# EAGLE design polarplotter allegro v3 shield (EAGLE 5.07)
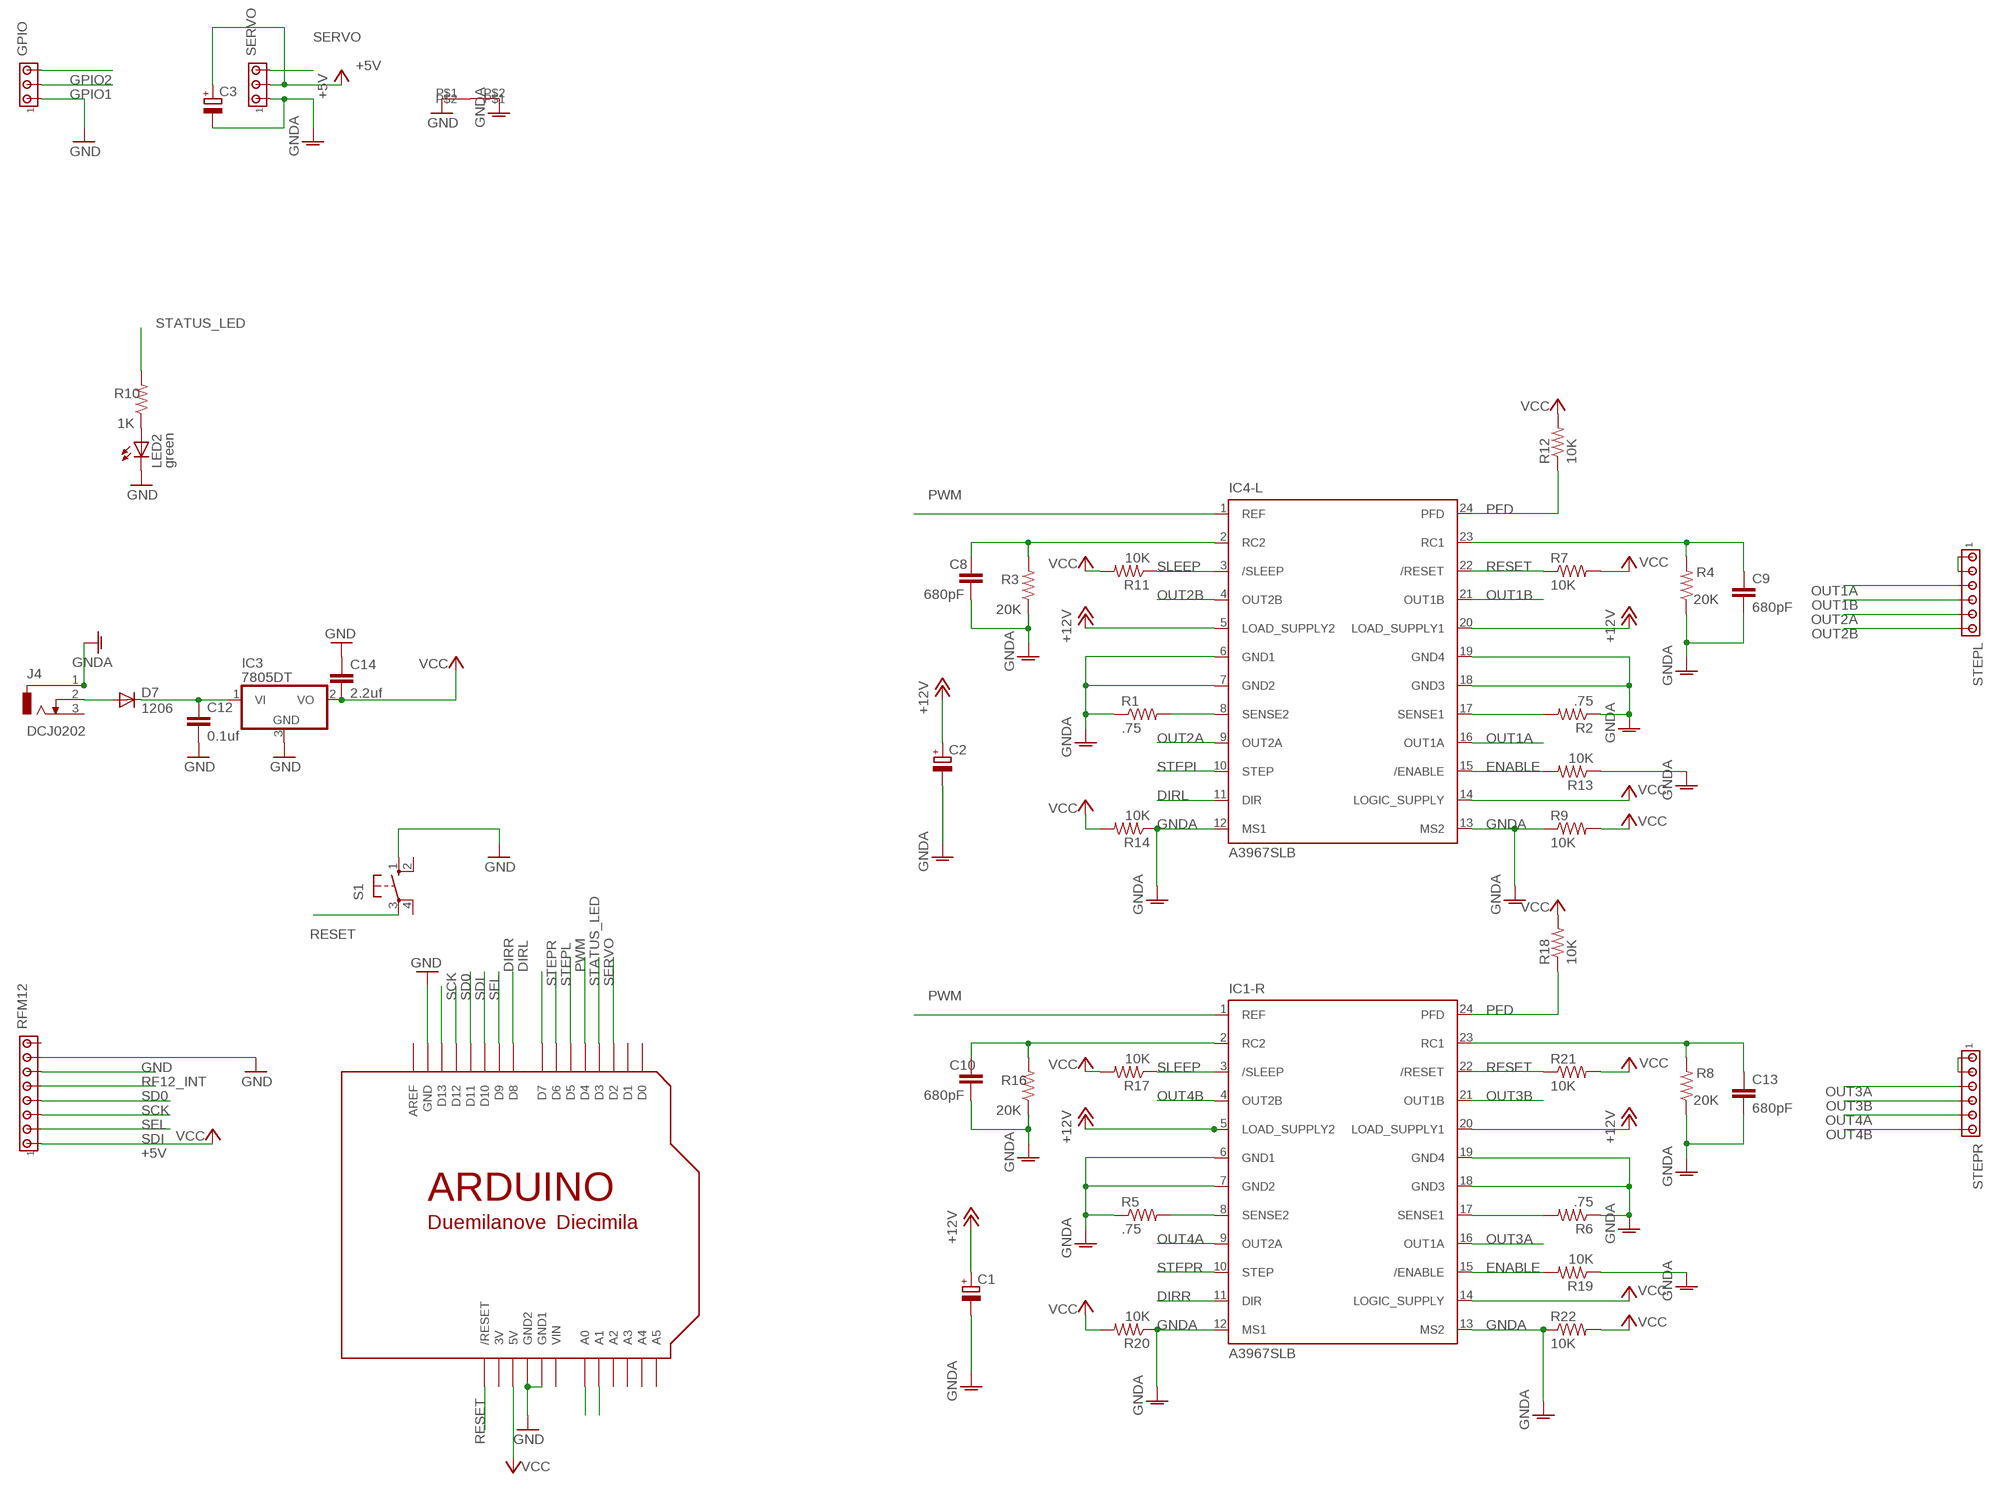
[diagram p0: schematic, sheet 1]

## Parts
C1  CPOL-EUC/6032-28R  [C/6032-28R]
C2  CPOL-EUC/6032-28R  [C/6032-28R]
C3  CPOL-EUC/6032-28R  [C/6032-28R]
C8  680pF  CAP0402  [C0402]
C9  680pF  CAP0402  [C0402]
C10  680pF  CAP0402  [C0402]
C12  0.1uf  C-EUC1206  [C1206]
C13  680pF  CAP0402  [C0402]
C14  2.2uf  C-EUC1206  [C1206]
D7  1206  DIODE-GF1  [GF1]
GPIO  MTA03-100  [10X03MTA]
IC1-R  A3967SLB  [SO24W]
IC3  7805DT  [TO252]
IC4-L  A3967SLB  [SO24W]
J4  DCJ0202  [DCJ0202]
LED2  green  LED5MM  [LED5MM]
R1  .75  R-US_R0805  [R0805]
R2  .75  R-US_R0805  [R0805]
R3  20K  RESISTOR0402  [C0402]
R4  20K  RESISTOR0402  [C0402]
R5  .75  R-US_R0805  [R0805]
R6  .75  R-US_R0805  [R0805]
R7  10K  RESISTOR0402  [C0402]
R8  20K  RESISTOR0402  [C0402]
R9  10K  RESISTOR0402  [C0402]
R10  1K  RESISTOR0402  [C0402]
R11  10K  RESISTOR0402  [C0402]
R12  10K  RESISTOR0402  [C0402]
R13  10K  RESISTOR0402  [C0402]
R14  10K  RESISTOR0402  [C0402]
R16  20K  RESISTOR0402  [C0402]
R17  10K  RESISTOR0402  [C0402]
R18  10K  RESISTOR0402  [C0402]
R19  10K  RESISTOR0402  [C0402]
R20  10K  RESISTOR0402  [C0402]
R21  10K  RESISTOR0402  [C0402]
R22  10K  RESISTOR0402  [C0402]
RFM12  MTA08-100  [10X08MTA]
S1  10-XX  [B3F-10XX]
SERVO  MTA03-100  [10X03MTA]
STEPL  MTA06-100  [10X06MTA]
STEPR  MTA06-100  [10X06MTA]
U$1  ARDUINO-NOHOLE  [ARDUINO-NOHOLE]
U$4  SHORT  [SHORT]

## Nets
+5V: C3.+ R12.2 R18.2 RFM12.1 SERVO.2 U$1.5V ; supply symbol labelled VCC
+12V [power]: C1.+ C2.+ IC1-R.5(LOAD_SUPPLY2) IC1-R.20(LOAD_SUPPLY1) IC4-L.5(LOAD_SUPPLY2) IC4-L.20(LOAD_SUPPLY1)
DIRL: IC4-L.11(DIR) U$1.D8
DIRR: IC1-R.11(DIR) U$1.D9
ENABLE: IC1-R.15(/ENABLE) IC4-L.15(/ENABLE) R13.2 R19.2
GND: C12.2 C14.1 GPIO.1 IC3.3(GND) LED2.K(C) RFM12.7 S1.1(S) U$1.GND U$1.GND1 U$1.GND2 U$4.P$1
GNDA [power]: C1.- C2.- C3.- C8.2 C9.2 C10.2 C13.2 IC1-R.6(GND1) IC1-R.7(GND2) IC1-R.12(MS1) IC1-R.13(MS2) IC1-R.18(GND3) IC1-R.19(GND4) IC4-L.6(GND1) IC4-L.7(GND2) IC4-L.12(MS1) IC4-L.13(MS2) IC4-L.18(GND3) IC4-L.19(GND4) J4.1 R1.1 R2.1 R3.1 R4.1 R5.1 R6.1 R8.1 R9.1 R13.1 R14.1 R16.1 R19.1 R20.1 R22.1 SERVO.1 U$4.P$2
GPIO1: GPIO.2 U$1.A0
GPIO2: GPIO.3 U$1.A1
MOTORSUPPLY [power]: STEPL.5 STEPL.6
MOTORSUPPLY1 [power]: STEPR.5 STEPR.6
N$1: IC1-R.8(SENSE2) R5.2
N$2: D7.A J4.2
N$3: IC4-L.8(SENSE2) R1.2
N$4: IC1-R.17(SENSE1) R6.2
N$5: LED2.A R10.1
N$6: C10.1 IC1-R.2(RC2) R16.2
N$7: C13.1 IC1-R.23(RC1) R8.2
N$10 [medpower]: C12.1 D7.C IC3.1(VI)
N$14: IC4-L.17(SENSE1) R2.2
N$16: C8.1 IC4-L.2(RC2) R3.2
N$20: C9.1 IC4-L.23(RC1) R4.2
OUT1A: IC4-L.16(OUT1A) STEPL.4
OUT1B: IC4-L.21(OUT1B) STEPL.3
OUT2A: IC4-L.9(OUT2A) STEPL.2
OUT2B: IC4-L.4(OUT2B) STEPL.1
OUT3A: IC1-R.16(OUT1A) STEPR.4
OUT3B: IC1-R.21(OUT1B) STEPR.3
OUT4A: IC1-R.9(OUT2A) STEPR.2
OUT4B: IC1-R.4(OUT2B) STEPR.1
PFD: IC1-R.24(PFD) IC4-L.24(PFD) R12.1 R18.1
PWM: IC1-R.1(REF) IC4-L.1(REF) U$1.D5
RESET: IC1-R.22(/RESET) IC4-L.22(/RESET) R7.1 R21.1 S1.3(P) U$1.RESET(/RESET)
RF12_INT: RFM12.6 U$1.D2
SCK: RFM12.4 U$1.D13
SD0: RFM12.5 U$1.D12
SDI: RFM12.2 U$1.D11
SEL: RFM12.3 U$1.D10
SERVO: SERVO.3 U$1.D3
SLEEP: IC1-R.3(/SLEEP) IC4-L.3(/SLEEP) R11.1 R17.1
STATUS_LED: R10.2 U$1.D4
STEPL: IC4-L.10(STEP) U$1.D6
STEPR: IC1-R.10(STEP) U$1.D7
VCC: C14.2 IC1-R.14(LOGIC_SUPPLY) IC3.2(VO) IC4-L.14(LOGIC_SUPPLY) R7.2 R9.2 R11.2 R14.2 R17.2 R20.2 R21.2 R22.2
Unconnected: J4.3 RFM12.8 S1.2(S1) S1.4(P1) U$1.A2 U$1.A3 U$1.A4 U$1.A5 U$1.AREF U$1.D0 U$1.D1

## Power pins joined to a net without a drawn wire
3V: U$1.3V
VIN: U$1.VIN

## Library data of the parts
C1-C3 = matt rcl:CPOL-EU: POLARIZED CAPACITOR, European symbol
C8-C10 C13 = SparkFun03_30_09:CAP: Capacitor Standard 0603 ceramic capacitor, and 0.1" leaded capacitor.
C12 C14 = resistor:C-EU: CAPACITOR, European symbol
D7 = matt diode:DIODE-: DIODE
GPIO SERVO = matt con-amp:MTA03-100: AMP connector
IC1-R IC4-L = Allegro:A3967SLB: ANALOG DEVICES
IC3 = linear:78*: Positive VOLTAGE REGULATOR Source: http://cache.national.com/ds/LM/LM78L05.pdf http://www.fairchildsemi.com/ds/LM/LM7805.pdf
J4 = con-jack:DCJ0202: DC POWER JACK Source: DCJ0202.pdf
LED2 = matt led:LED: LED OSRAM: - CHIPLED LG R971, LG N971, LY N971, LG Q971, LY Q971, LO R971, LY R971 LH N974, LH R974 LS Q976, LO Q976, LY Q976 LO Q996 - Hyper CHIPLED LW Q18S LB Q993, LB Q99A, LB R99A - SideLED LS A670, LO A670, LY A670, LG A670, LP A670 LB A673, LV A673, LT A673, LW A673 LH A674 LY A675 LS A676, LA A676, LO A676, LY A676, LW A676 LS A679, LY A679, LG A679 - Hyper Micro SIDELED® LS Y876, LA Y876, LO Y876, LY Y876 LT Y87S - SmartLED LW L88C, LW L88S LB L89C, LB L89S, LG L890 LS L89K, LO L89K, LY L89K LS L896, LA L896, LO L896, LY L896 - TOPLED LS T670, LO T670, LY T670, LG T670, LP T670 LSG T670, LSP T670, LSY T670, LOP T670, LYG T670 LG T671, LOG T671, LSG T671 LB T673, LV T673, LT T673, LW T673 LH T674 LS T676, LA T676, LO T676, LY T676, LB T676, LH T676, LSB T676, LW T676 LB T67C, LV T67C, LT T67C, LS T67K, LO T67K, LY T67K, LW E67C LS E67B, LA E67B, LO E67B, LY E67B, LB E67C, LV E67C, LT E67C LW T67C LS T679, LY T679, LG T679 LS T770, LO T770, LY T770, LG T770, LP T770 LB T773, LV T773, LT T773, LW T773 LH T774 LS E675, LA E675, LY E675, LS T675 LS T776, LA T776, LO T776, LY T776, LB T776 LHGB T686 LT T68C, LB T68C - Hyper Mini TOPLED® LB M676 - Mini TOPLED Santana® LG M470 LS M47K, LO M47K, LY M47K Source: http://www.osram.convergy.de LUXEON: - LUMILED® LXK2-PW12-R00, LXK2-PW12-S00, LXK2-PW14-U00, LXK2-PW14-V00 LXK2-PM12-R00, LXK2-PM12-S00, LXK2-PM14-U00 LXK2-PE12-Q00, LXK2-PE12-R00, LXK2-PE12-S00, LXK2-PE14-T00, LXK2-PE14-U00 LXK2-PB12-K00, LXK2-PB12-L00, LXK2-PB12-M00, LXK2-PB14-N00, LXK2-PB14-P00, LXK2-PB14-Q00 LXK2-PR12-L00, LXK2-PR12-M00, LXK2-PR14-Q00, LXK2-PR14-R00 LXK2-PD12-Q00, LXK2-PD12-R00, LXK2-PD12-S00 LXK2-PH12-R00, LXK2-PH12-S00 LXK2-PL12-P00, LXK2-PL12-Q00, LXK2-PL12-R00 Source: www.luxeon.com KINGBRIGHT: KA-3528ASYC Source: www.kingbright.com
R1 R2 R5 R6 = rcl:R-US_: RESISTOR, American symbol
R3 R4 R7-R14 R16-R22 = SparkFun03_30_09:RESISTOR: Resistor Basic schematic elements and footprints for 0603, 1206, and PTH 1/10th watt (small) resistors.
RFM12 = matt con-amp:MTA08-100: AMP connector
S1 = switch-omron:10-XX: OMRON SWITCH
STEPL STEPR = matt con-amp:MTA06-100: AMP connector
U$1 = adafruit:ARDUINO: Arduino Diecimila/Duemilanove Make a shield with ease, this package has all the named pins as well as the two mounting drill holes and an outline of the USB and DC power connector. The outline is on the DIMENSION layer, so if your board house uses it they will cut the outline to match. http://www.ladyada.net/library/pcb/eaglelibrary.html
U$4 = matt:SHORT

## Net classes
1 power: width 3 mm
2 medpower: width 1 mm

## Board
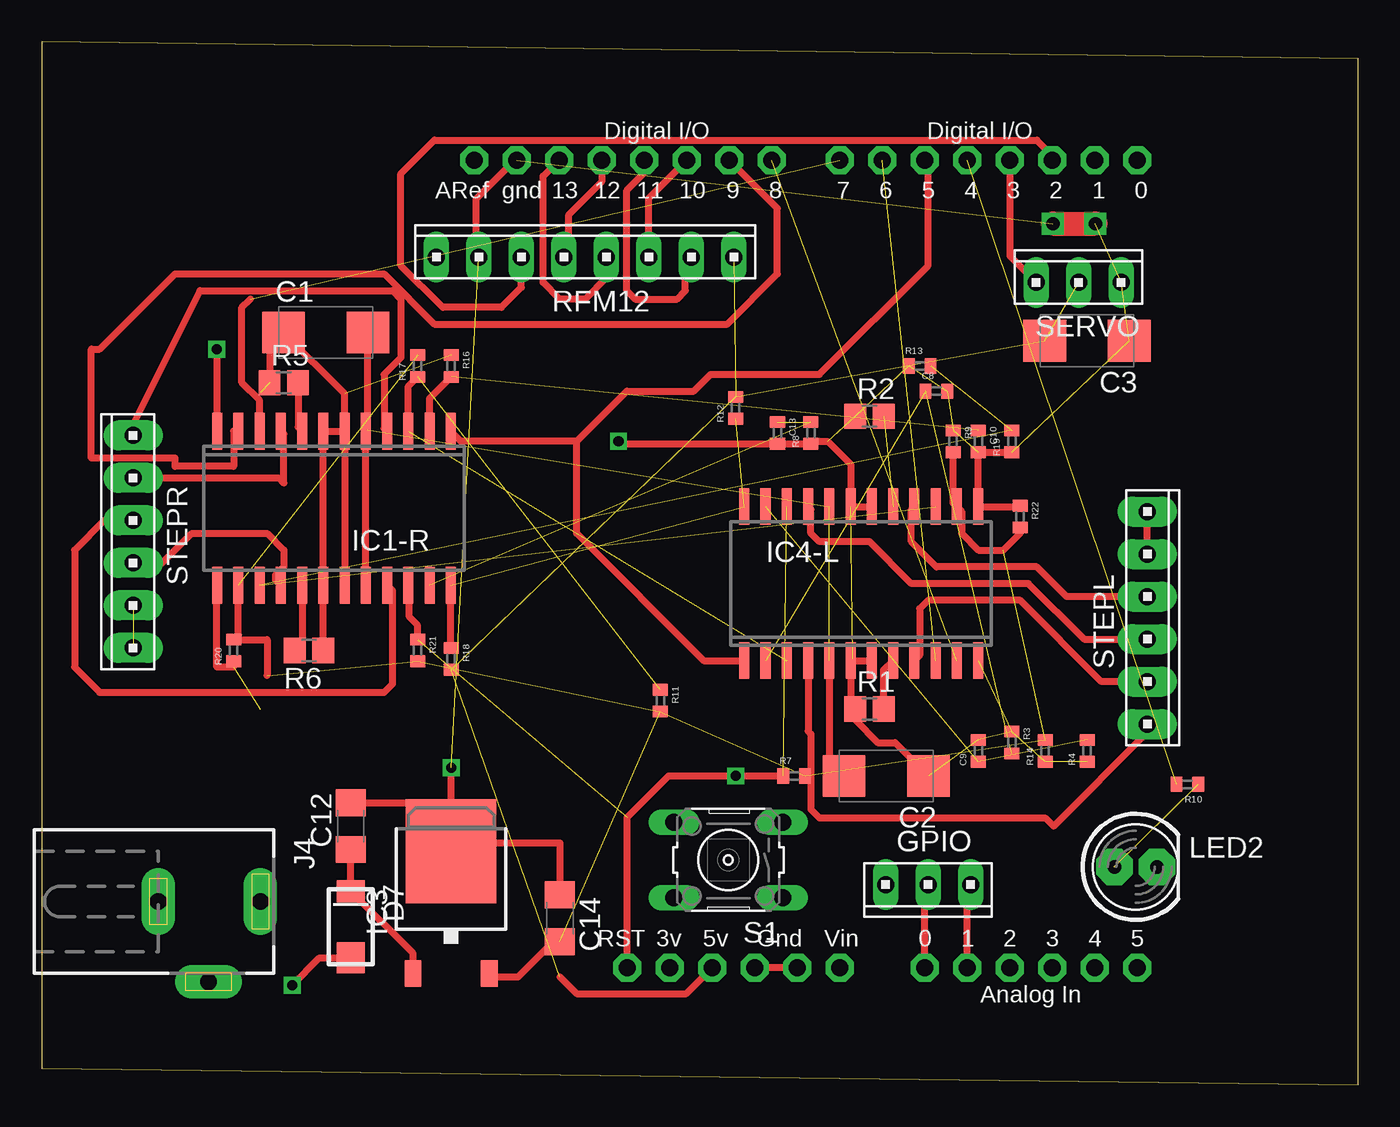
[diagram p1: board, top side]
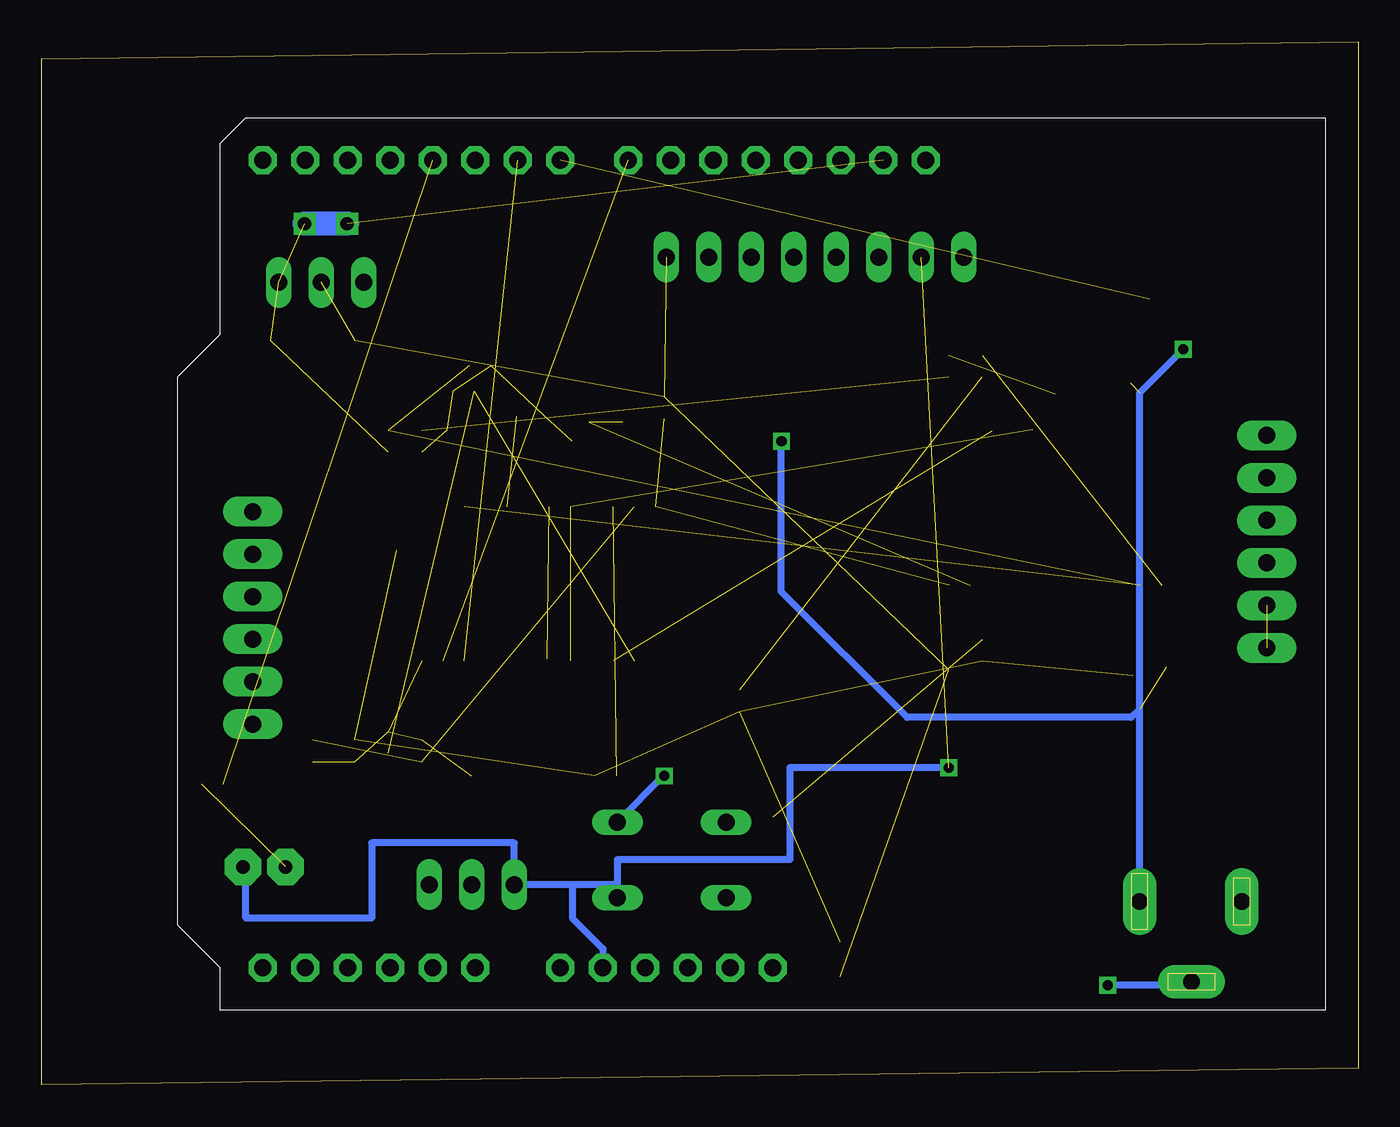
[diagram p2: board, bottom side, seen from below]

Size 78.66 x 62.33 mm. Coordinates in mm from the lower left corner, seen from the top.
Outline: 0,1 78.66,0 78.66,61.33 0,62.33 0,1
Copper layers (1*16): Top 0.035mm / dielectric 1.5mm / Bottom 0.035mm
Design rules "default": minimum track width 10mil, minimum drill 24mil, track to track 8mil, track to pad 8mil, pad to pad 8mil, via to via 8mil, smd to smd 8mil, copper to edge 40mil, drill to drill 8mil, minimum pad ring 10mil, minimum via ring 8mil, stop-mask expansion 4mil, vias tented up to drill 0mil, thermal gap 10mil

### Footprints (pad centres in the part's own frame; a part is rotated, then mirrored left to right if it is on the bottom)
C/6032-28R = smd 2.55 x 2.5: + 2.525,0; - -2.525,0
C0402 = smd 0.7 x 0.9: 1 -0.65,0; 2 0.65,0
C1206 = smd 1.6 x 1.8: 1 -1.4,0; 2 1.4,0
GF1 = smd 1.85 x 1.68: A 1.87,0 | smd 1.32 x 1.68: C -2.12,0
10X03MTA = drill 1.016 long: 1 2.54,0; 2 0,0; 3 -2.54,0
SO24W = smd 0.6 x 2.2: 1 -6.985,-4.6; 2 -5.715,-4.6; 3 -4.445,-4.6; 4 -3.175,-4.6; 5 -1.905,-4.6; 6 -0.635,-4.6; 7 0.635,-4.6; 8 1.905,-4.6; 9 3.175,-4.6; 10 4.445,-4.6; 11 5.715,-4.6; 12 6.985,-4.6; 13 6.985,4.6; 14 5.715,4.6; 15 4.445,4.6; 16 3.175,4.6; 17 1.905,4.6; 18 0.635,4.6; 19 -0.635,4.6; 20 -1.905,4.6; 21 -3.175,4.6; 22 -4.445,4.6; 23 -5.715,4.6; 24 -6.985,4.6
TO252 = smd 1 x 1.6: 1 -2.28,-4.8; 2 2.28,-4.8 | smd 5.4 x 6.2: 3 0,2.5
DCJ0202 = drill 1 pad 2 long: 1 0,3.1; 2 4.8,0; 3 0,-3
LED5MM = drill 0.813 pad 2.184 octagon: A -1.27,0; K 1.27,0
R0805 = smd 1.3 x 1.5: 1 -0.85,0; 2 0.85,0
10X08MTA = drill 1.016 long: 1 8.89,0; 2 6.35,0; 3 3.81,0; 4 1.27,0; 5 -1.27,0; 6 -3.81,0; 7 -6.35,0; 8 -8.89,0
B3F-10XX = drill 1.016 long: 1 -3.251,2.261; 2 3.251,2.261; 3 -3.251,-2.261; 4 3.251,-2.261
10X06MTA = drill 1.016 pad 1.778 long: 1 6.35,0; 2 3.81,0; 3 1.27,0; 4 -1.27,0; 5 -3.81,0; 6 -6.35,0
ARDUINO-NOHOLE = drill 1 pad 1.676 octagon: 3V 35.56,2.54; 5V 38.1,2.54; A0 50.8,2.54; A1 53.34,2.54; A2 55.88,2.54; A3 58.42,2.54; A4 60.96,2.54; A5 63.5,2.54; AREF 23.876,50.8; D0 63.5,50.8; D1 60.96,50.8; D2 58.42,50.8; D3 55.88,50.8; D4 53.34,50.8; D5 50.8,50.8; D6 48.26,50.8; D7 45.72,50.8; D8 41.656,50.8; D9 39.116,50.8; D10 36.576,50.8; D11 34.036,50.8; D12 31.496,50.8; D13 28.956,50.8; GND 26.416,50.8; GND1 43.18,2.54; GND2 40.64,2.54; RESET 33.02,2.54; VIN 45.72,2.54
SHORT = drill 0.8 square: P$1 -2.54,0; P$2 0,0

### Placement (x,y rotation side)
C1  16.96,44.96 0 top
C2  50.46,18.46 180 top
C3  62.46,44.46 180 top
C8  53.46,41.46 0 top
C9  55.96,19.96 90 top
C10  55.96,38.46 270 top
C12  18.46,15.46 90 top
C13  43.96,38.96 270 top
C14  30.96,9.96 270 top
D7  18.46,9.46 270 top
GPIO  52.96,11.96 180 top
IC1-R  17.46,34.46 180 top
IC3  24.46,11.46 0 top
IC4-L  48.96,29.96 0 top
J4  9.96,10.96 270 top
LED2  65.36,13.03 0 top
R1  49.46,22.46 0 top
R2  49.46,39.96 0 top
R3  57.96,20.46 270 top
R4  62.46,19.96 90 top
R5  14.46,41.96 0 top
R6  15.96,25.96 180 top
R7  44.96,18.46 0 top
R8  45.96,38.96 90 top
R9  54.46,38.46 270 top
R10  68.46,17.96 180 top
R11  36.96,22.96 270 top
R12  41.46,40.46 90 top
R13  52.46,42.96 0 top
R14  59.96,19.96 90 top
R16  24.46,42.96 270 top
R17  22.46,42.96 90 top
R18  24.46,25.46 270 top
R19  57.96,38.46 90 top
R20  11.46,25.96 90 top
R21  22.46,25.96 270 top
R22  58.46,33.96 270 top
RFM12  32.46,49.46 0 top
S1  41.02,13.44 180 top
SERVO  61.96,47.96 0 top
STEPL  66.06,27.91 270 top
STEPR  5.46,32.46 90 top
U$1  1.96,4.46 0 top
U$4  62.96,51.46 0 top

### Tracks (layer width: path | path; a pad name or v marks a point on that pad's centre or on a via)
+5V  (5 unrouted)
  Top 0.406: 30.96,6.46 31.96,5.46 38.52,5.46 U$1.5V
+12V  (2 unrouted)
  Top 0.406: C1.+ 19.48,39.98 19.46,39.96 19.46,39.16 IC1-R.5 IC1-R.20 | IC4-L.5 47.05,19.34 C2.+
DIRL  (1 unrouted)
DIRR
  Top 0.406: IC1-R.11 11.46,39.06 11.46,36.96 7.96,36.96 7.96,37.46 2.96,37.46 2.96,43.96 3.46,43.96 7.96,48.46 20.46,48.46 23.46,45.46 40.96,45.46 43.96,48.46 43.96,52.38 U$1.D9
ENABLE  (3 unrouted)
GND  (via drill 0.6)  (2 unrouted)
  Top 0.406: C12.2 24.46,16.86 | 24.46,16.86 24.46,14.46 | 24.46,14.46 IC3.3 | C14.1 30.96,14.46 24.46,14.46 | 24.46,16.86 v24.46,18.96 | U$1.GND1 U$1.GND2 | U$1.GND 28.26,55.26 25.96,52.96 25.96,50.46 26.46,49.96 26.46,49.81 RFM12.7
  Bottom 0.406: v24.46,18.96 33.96,18.96 33.96,13.46 44.27,13.46 S1.1 | 44.96,11.46 44.27,11.46 S1.1 | 46.96,11.96 44.27,11.96 S1.1 | 46.96,11.96 GPIO.1 50.42,14.46 58.96,14.46 58.96,9.96 66.46,9.96 66.46,13.03 LED2.K | U$1.GND1 45.14,8.14 46.96,9.96 46.96,11.96
GNDA  (via drill 0.6)  (17 unrouted)
  Top 0.406: IC1-R.6 IC1-R.19 | IC1-R.6 18.1,41.3 C1.- | IC1-R.6 IC1-R.7 IC1-R.18 16.82,25.98 R6.1 | R5.1 13.61,44.13 C1.- | C1.- 13.94,45.46 | IC4-L.18 IC4-L.19 48.33,37.09 46.96,38.46 46.11,38.46 R8.1 C13.2 34.61,38.31 v34.46,38.46 | IC1-R.13 10.46,29.86 10.46,24.96 11.46,24.96 R20.1 | IC1-R.12 10.46,39.06 v10.46,43.96 | R19.1 C10.2 55.95,37.8 IC4-L.13 58.41,34.56 R22.1 | 48.36,25.36 48.46,25.46 | 48.36,25.36 IC4-L.7 | 48.36,25.36 IC4-L.6 | 48.36,25.36 48.36,22.71 R1.1 48.61,21.81 49.96,20.46 50.98,20.46 C2.-
  Bottom 0.406: J4.1 13.06,22.46 | 13.06,22.46 13.06,41.36 v10.46,43.96 | v34.46,38.46 34.46,29.46 26.96,21.96 13.56,21.96 13.06,22.46
GPIO1
  Top 0.406: U$1.A0 52.76,11.76 GPIO.2
GPIO2
  Top 0.406: U$1.A1 55.3,11.76 GPIO.3
MOTORSUPPLY
  Top 0.406: STEPL.5 66.06,33.36 65.46,33.96 65.96,33.96 66.46,34.46 66.26,34.46 STEPL.6
MOTORSUPPLY1  (1 unrouted)
N$1
  Top 0.406: R5.2 15.31,39.3 IC1-R.8
N$2  (via drill 0.6)
  Top 0.406: D7.A 16.59,7.59 v14.96,5.96 | J4.2 10.16,5.96
  Bottom 0.406: v14.96,5.96 10.16,5.96 J4.2
N$3
  Top 0.406: R1.2 50.31,24.8 IC4-L.8
N$4
  Top 0.406: IC1-R.17 15.55,26.41 R6.2
N$5  (1 unrouted)
N$6  (1 unrouted)
  Top 0.406: IC1-R.2 23.18,41.02 R16.2
N$7  (2 unrouted)
N$10
  Top 0.406: C12.1 D7.C 22.18,7.86 IC3.1
N$14  (1 unrouted)
N$16  (2 unrouted)
N$20  (2 unrouted)
OUT1A
  Top 0.406: STEPL.4 61.24,29.18 59.46,30.96 53.46,30.96 51.96,32.46 51.96,34.38 IC4-L.16
OUT1B
  Top 0.406: STEPL.3 62.28,26.64 58.96,29.96 51.96,29.96 49.46,32.46 46.46,32.46 45.96,32.96 45.96,34.38 IC4-L.21
OUT2A
  Top 0.406: STEPL.2 63.32,24.1 58.46,28.96 52.96,28.96 52.46,28.46 52.46,25.69 IC4-L.9
OUT2B
  Top 0.406: STEPL.1 66.06,21.06 60.46,15.46 59.96,15.96 46.46,15.96 45.96,16.46 45.96,20.96 45.79,21.14 IC4-L.4
OUT3A
  Top 0.406: STEPR.4 7.19,31.19 8.96,32.96 13.46,32.96 14.46,31.96 14.46,30.96 13.96,30.46 13.96,30.19 IC1-R.16
OUT3B
  Top 0.406: STEPR.3 3.73,33.73 1.96,31.96 1.96,24.96 3.46,23.46 20.46,23.46 20.96,23.96 20.96,29.54 IC1-R.21
OUT4A
  Top 0.406: STEPR.2 14.15,36.27 14.46,35.96 14.46,38.88 IC1-R.9
OUT4B
  Top 0.406: STEPR.1 5.46,39.46 9.46,47.46 20.96,47.46 21.46,46.96 21.46,43.46 20.46,42.46 20.46,39.23 IC1-R.4
PFD  (2 unrouted)
  Top 0.406: IC1-R.24 24.45,26.12 R18.1
PWM
  Top 0.406: IC4-L.1 39.56,25.36 31.96,32.96 31.96,38.46 | 31.96,38.46 34.96,41.46 38.96,41.46 39.96,42.46 46.46,42.46 52.96,48.96 52.96,55.06 U$1.D5 | 31.96,38.46 25.05,38.46 IC1-R.1
RESET  (via drill 0.6)  (2 unrouted)
  Top 0.406: R21.1 22.46,27.46 21.96,27.96 21.96,29.8 IC1-R.22 | U$1.RESET 34.98,15.98 37.46,18.46 v41.46,18.46 R7.1
  Bottom 0.406: v41.46,18.46 41.51,18.46 S1.3
RF12_INT
  Top 0.406: RFM12.6 28.65,47.65 27.46,46.46 23.96,46.46 21.46,48.96 21.46,54.46 23.46,56.46 59.46,56.46 60.96,54.96 60.96,55.46 60.58,55.46 U$1.D2
SCK
  Top 0.406: RFM12.4 33.73,48.23 32.46,46.96 30.96,46.96 29.96,47.96 29.96,54.3 U$1.D13
SD0
  Top 0.406: U$1.D12 33.46,53.96 31.46,51.96 31.46,49.73 RFM12.5
SDI
  Top 0.406: RFM12.2 38.46,49.11 38.46,47.46 37.96,46.96 35.46,46.96 34.96,47.46 34.96,53.46 36,54.5 U$1.D11
SEL
  Top 0.406: RFM12.3 36.27,52.99 U$1.D10
SERVO
  Top 0.406: U$1.D3 57.84,49.54 SERVO.3
SLEEP  (2 unrouted)
  Top 0.406: IC1-R.3 21.91,41.76 R17.1
STATUS_LED  (1 unrouted)
STEPL  (1 unrouted)
STEPR  (1 unrouted)
  Top 0.406: IC1-R.10 13.02,40.91 11.96,41.96 11.96,46.46 12.46,46.96
VCC  (7 unrouted)
  Top 0.406: IC1-R.14 11.75,26.89 R20.2 13.46,26.61 13.46,24.46 | C14.2 30.56,8.56 28.46,6.46 26.94,6.46 IC3.2 | R9.2 54.46,34.77 IC4-L.14 54.96,34.27 54.96,32.96 55.96,31.96 57.46,31.96 58.46,32.96 R22.2